# EAGLE design LinkMeter-Button (EAGLE 5.09)
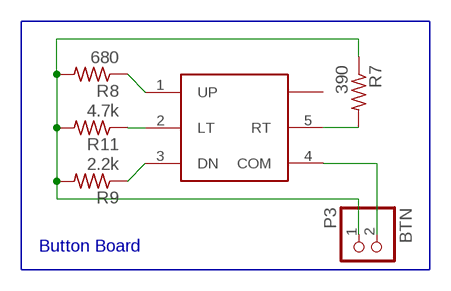
[diagram p0: schematic, sheet 1]

## Parts
P3  BTN  PINHD-1X2  [1X02]
R7  390  R-US_0204/7  [0204/7]
R8  680  R-US_0204/7  [0204/7]
R9  2.2k  R-US_0204/7  [0204/7]
R11  4.7k  R-US_0204/7  [0204/7]
S2  TACTILE-4  [TACT4]

## Nets
COM: P3.2 S2.4(COM)
DOWN: R9.1 S2.3(DN)
LEFT: R11.1 S2.2(LT)
RIGHT: R7.2 S2.5(RT)
UP: R8.1 S2.1(UP)
VCC: P3.1 R7.1 R8.2 R9.2 R11.2
Unconnected: S2.6(NC)

## Buses
B$4

## Notes on the sheet
- Button Board

## Library data of the parts
P3 = pinhead:PINHD-1X2: PIN HEADER
R7-R9 R11 = resistor:R-US_: RESISTOR, American symbol
S2 = Steve:TACTILE-4: ALPS SKQUAAA010 Multi Directional Switch - Mouser

## Board
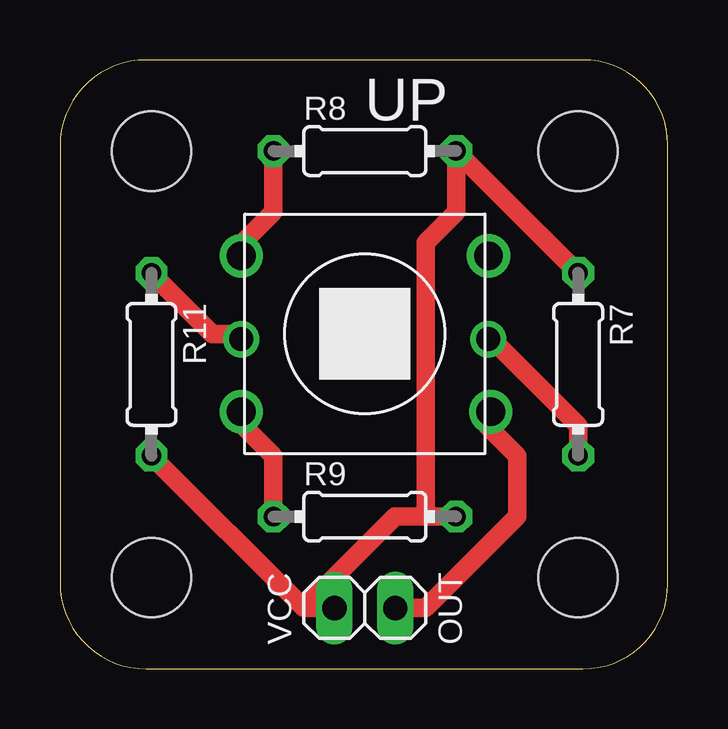
[diagram p1: board, top side]
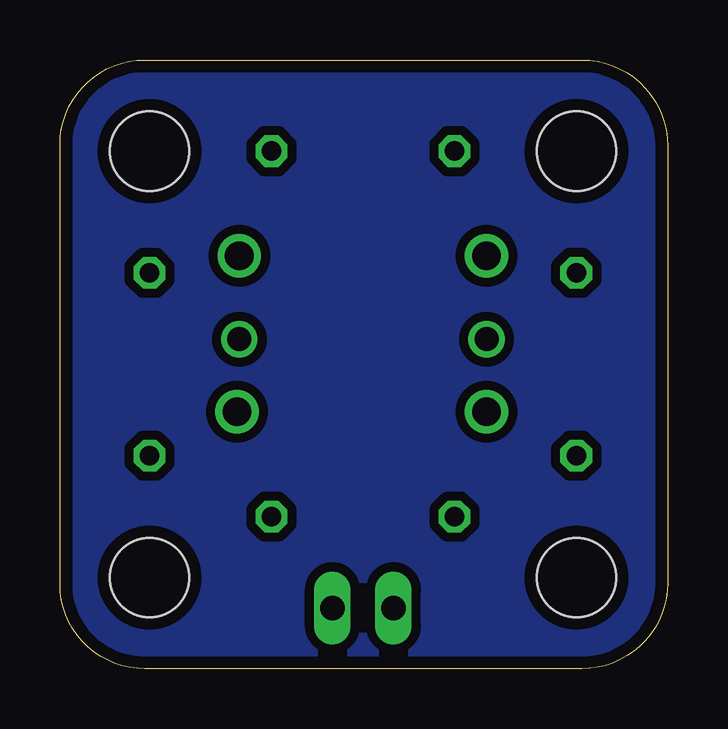
[diagram p2: board, bottom side, seen from below]

Size 25.32 x 25.39 mm. Coordinates in mm from the lower left corner, seen from the top.
Outline: 21.79,0 arc90 25.32,3.54 25.32,21.86 arc90 21.79,25.39 3.58,25.39 arc90 0,21.8 0,3.59 arc90 3.59,0 21.79,0
Copper layers (1*16): Top 0.035mm / dielectric 1.5mm / Bottom 0.035mm
Design rules "default *": minimum track width 30mil, minimum drill 24mil, track to track 15mil, track to pad 15mil, pad to pad 8mil, via to via 8mil, smd to smd 8mil, copper to edge 20mil, drill to drill 8mil, minimum pad ring 10mil, minimum via ring 8mil, stop-mask expansion 4mil, vias tented up to drill 0mil, thermal gap 10mil

### Footprints (pad centres in the part's own frame; a part is rotated, then mirrored left to right if it is on the bottom)
STAND-OFF = hole 3.302: 0,0
1X02 = drill 1.016 long: 1 -1.27,0; 2 1.27,0
0204/7 = drill 0.813 octagon: 1 -3.81,0; 2 3.81,0
TACT4 = drill 1.2 round: 1 -5.15,3.25; 3 -5.15,-3.25; 4 5.25,-3.25; 6 5.15,3.25 | drill 1 round: 2 -5.15,-0.225; 5 5.15,-0.225

### Placement (x,y rotation side)
JP1  STAND-OFF  [STAND-OFF]  3.81,21.59 0 top
JP2  STAND-OFF  [STAND-OFF]  21.59,21.59 0 top
JP3  STAND-OFF  [STAND-OFF]  21.59,3.81 0 top
JP4  STAND-OFF  [STAND-OFF]  3.81,3.81 0 top
P3  12.7,2.54 0 top
R7  21.59,12.7 270 top
R8  12.7,21.59 0 top
R9  12.7,6.35 0 top
R11  3.81,12.7 270 top
S2  12.7,13.97 0 top

### Tracks (layer width: path | path; a pad name or v marks a point on that pad's centre or on a via)
COM
  Top 0.762: P3.2 15.24,2.54 19.05,6.35 19.05,8.89 17.78,10.16 S2.4
DOWN
  Top 0.762: R9.1 8.89,8.89 7.62,10.16 S2.3
GND
  pour Bottom: 3.59,0 arc-90 0,3.59 0,21.81 arc-90 3.59,25.4 21.81,25.4 arc-90 25.4,21.81 25.4,3.59 arc-90 21.81,0
LEFT
  Top 0.762: R11.1 6.35,13.97 7.62,13.97 S2.2
RIGHT
  Top 0.762: R7.2 21.59,10.16 17.78,13.97 S2.5
UP
  Top 0.762: R8.1 8.89,19.05 7.62,17.78 S2.1
VCC
  Top 0.762: R7.1 R8.2 16.51,19.05 15.24,17.78 15.24,6.35 | R11.2 10.16,2.54 | 10.16,2.54 P3.1 | 15.24,6.35 13.97,6.35 10.16,2.54 | 15.24,6.35 R9.2

### Text on the board
_tsilk: UP | VCC | OUT
_bsilk: UP | LM Button v1 | RIGHT | LEFT | DOWN